# EAGLE design AmbaSat-05-ZMOD4410 (EAGLE 9.5.1)
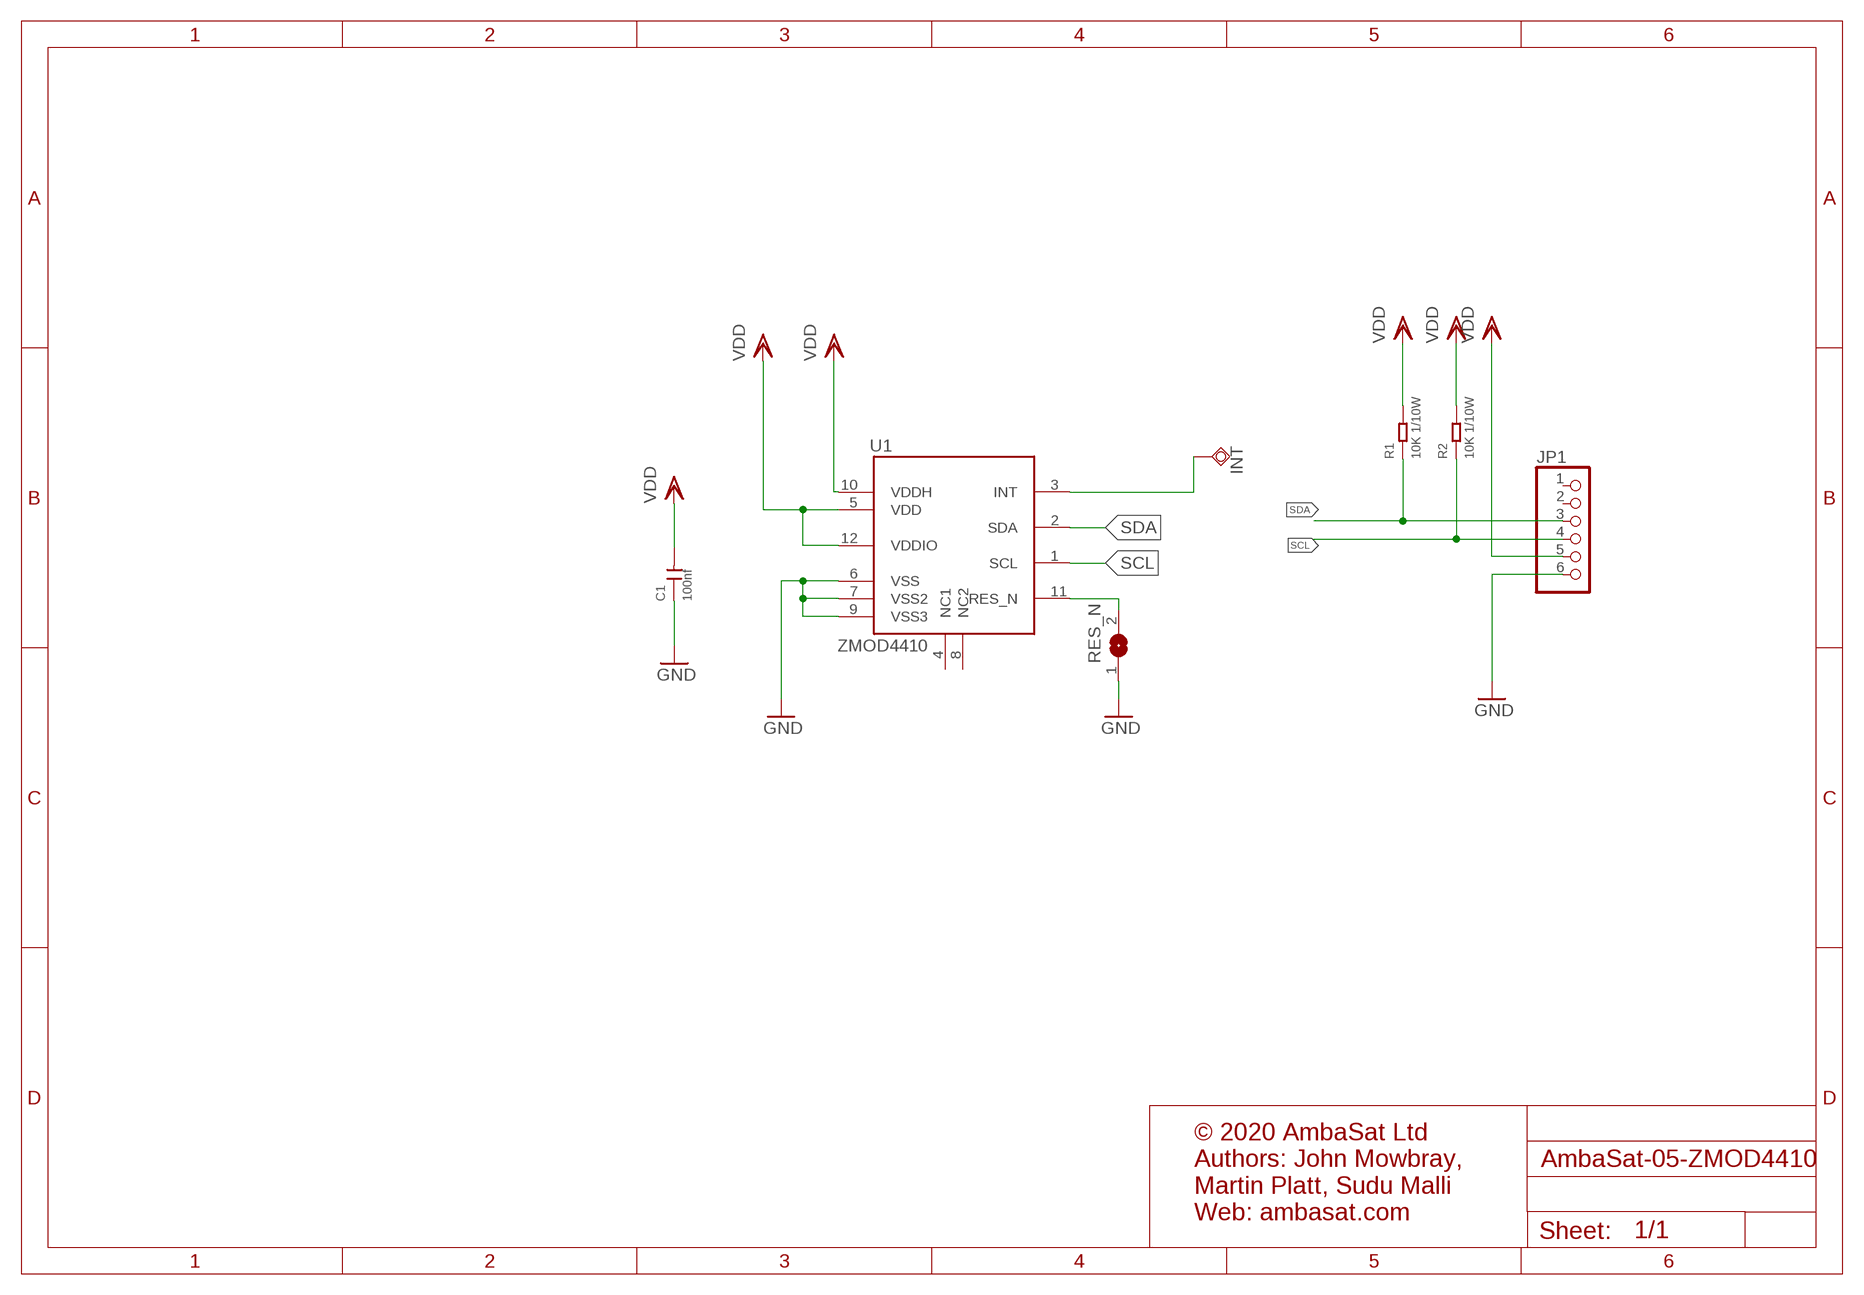
[diagram p0: schematic, sheet 1]

## Parts
C1  100nf  CERAMIC-100NF-50V-10%-X7R(0603)  [C0603]
INT  TESTPAD_TPSQTP12R  [TESTPAD_TP12R]
JP1  HEADER-1X6  [1X06_OVAL]
R1  10K 1/10W  SMD-RES-10K-5%-1/10W(0603)  [R0603]
R2  10K 1/10W  SMD-RES-10K-5%-1/10W(0603)  [R0603]
RES_N  SJ  [SJ]
U1  ZMOD4410  [LGG12D1_3X3X0.7_0.5X1]

## Nets
GND: C1.1 JP1.6 RES_N.1 U1.6(VSS) U1.7(VSS2) U1.9(VSS3)
N$1: INT.TP U1.3(INT)
N$2: RES_N.2 U1.11(RES_N)
SCL: JP1.4 R2.1 U1.1(SCL)
SDA: JP1.3 R1.1 U1.2(SDA)
VDD: C1.2 JP1.5 R1.2 R2.2 U1.5(VDD) U1.10(VDDH) U1.12(VDDIO)
Unconnected: JP1.1 JP1.2 U1.4(NC1) U1.8(NC2)

## Notes on the sheet
- © 2020 AmbaSat Ltd
  Authors: John Mowbray, 
  Martin Platt, Sudu Malli
  Web: ambasat.com

## Library data of the parts
C1 = Seeed-Capacitor:CERAMIC-100NF-50V-10%-X7R(0603): 302010138; MPN: CC0603KRX7R9BB104
INT = BeagleBone_Blue_R3:TESTPAD_TPSQ: Test pad
JP1 = microbuilder:HEADER-1X6: PIN HEADER
R1 R2 = Seeed-Resistor:SMD-RES-10K-5%-1/10W(0603): 301010293; MPN: RC0603JR-0710KL
RES_N = jumper:SJ: SMD solder JUMPER
U1 = ZMOD4410AI1V:ZMOD4410: Description The ZMOD4410 Gas Sensor Module is designed for detecting total volatile organic compounds (TVOC) and monitoring indoor air quality (IAQ) in different use cases. It is a 12-pin LGA assembly (3.0  3.0  0.7 mm) that consists of a gas sense element and a CMOS signal conditioning IC. The module’s sense element consists of heater element on a Si-based MEMS structure and a metal oxide (MOx) chemiresistor. The signal conditioner controls the sensor temperature and measures the MOx conductivity, which is a function of the gas concentration. The measurement results can be read via an I2C interface with the user’s microprocessor, which processes the data to determine the TVOC concentration, IAQ rating, and estimated carbon dioxide (eCO2) level. Alternatively, depending on the operation mode, the ZMOD4410 software can generate a control signal, which can trigger actions based on odor levels. With its low operating current consumption in Low-Power Operation Mode, the ZMOD4410 is an excellent choice for low-voltage and low-power battery applications. Built-in nonvolatile memory (NVM) stores the configuration and provides space for arbitrary user data.; DIGIKEY-PN: 1833-1030-ND; MANUFACTURER: IDT, Integrated Device Technology Inc; MPN: ZMOD4410AI1V

## Board
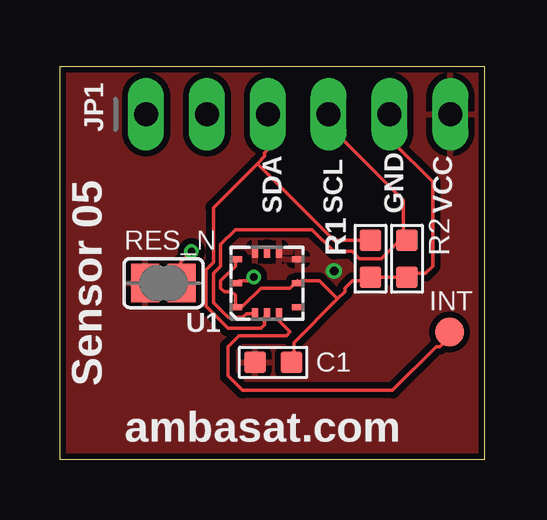
[diagram p1: board, top side]
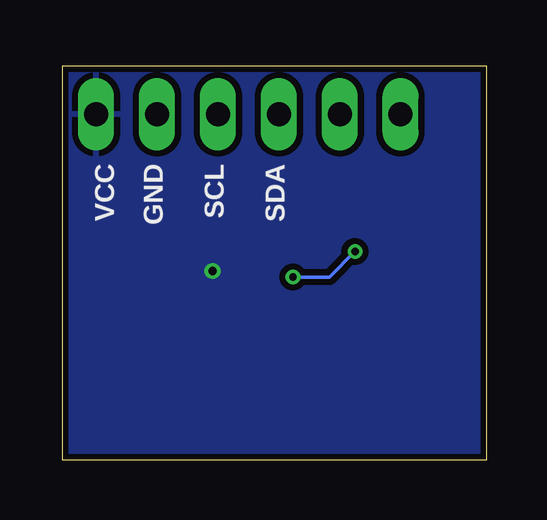
[diagram p2: board, bottom side, seen from below]

Size 17.7 x 16.4 mm. Coordinates in mm from the lower left corner, seen from the top.
Outline: 0,16.4 17.7,16.4 17.7,0 0,0 0,16.4
Copper layers (1*16): Top 0.035mm / dielectric 1.5mm / Bottom 0.035mm
Design rules "SeeedStudio_2layer_DRU_no_angle_20140221": minimum track width 6mil, minimum drill 12mil, track to track 6mil, track to pad 6mil, pad to pad 6mil, via to via 6mil, smd to smd 0mil, copper to edge 10mil, drill to drill 10mil, minimum pad ring 10mil, minimum via ring 6mil, stop-mask expansion 2mil, vias tented up to drill 100mil, thermal gap 10mil

### Footprints (pad centres in the part's own frame; a part is rotated, then mirrored left to right if it is on the bottom)
C0603 = smd 0.889 x 0.889: 1 0,0.762; 2 0,-0.762
TESTPAD_TP12R = smd 1.2 x 1.2: TP 0,0
1X06_OVAL = drill 1 long: 1 -6.35,0; 2 -3.81,0; 3 -1.27,0; 4 1.27,0; 5 3.81,0; 6 6.35,0
R0603 = smd 0.889 x 0.889: 1 0,0.762; 2 0,-0.762
SJ = smd 1.168 x 1.6: 1 -0.762,0; 2 0.762,0
LGG12D1_3X3X0.7_0.5X1 = smd 0.25 x 0.5: 1 -0.5,-1.3; 2 0,-1.3; 3 0.5,-1.3; 7 0.5,1.3; 8 0,1.3; 9 -0.5,1.3 | smd 0.5 x 0.25: 4 1.3,-1; 5 1.3,0; 6 1.3,1; 10 -1.3,1; 11 -1.3,0; 12 -1.3,-1

### Placement (x,y rotation side)
C1  8.89,4.06 90 top
INT  16.26,5.33 0 top
JP1  9.94,14.4 0 top
R1  12.95,8.38 0 top
R2  14.48,8.38 0 top
RES_N  4.32,7.37 0 top
U1  8.64,7.37 0 top

### Tracks (layer width: path | path; a pad name or v marks a point on that pad's centre or on a via)
GND  (via drill 0.35)
  other vias: 11.43,7.87
  pour Top (isolate 0.254): 0,16.4 0,0 17.7,0 17.7,16.4
  pour Bottom (isolate 0.254): 0,16.4 0,0 17.7,0 17.7,16.4
N$1
  Top 0.152: U1.3 9.14,5.94 9.14,5.79 9.6,5.33 9.45,5.18 7.47,5.18 7.01,4.72 7.01,3.5 7.62,2.9 13.87,2.9 15.7,4.72 15.85,4.72 16.15,5.03 16.15,5.33 INT.TP
N$2  (via drill 0.3)
  Top 0.152: v8.08,7.62 7.92,7.47 7.47,7.47 U1.11 | v5.49,8.69 5.03,8.23 5.03,7.47 RES_N.2
  Bottom 0.152: v8.08,7.62 6.55,7.62 v5.49,8.69
SCL
  Top 0.152: 14.33,9.14 14.17,9.14 13.41,8.38 12.5,8.38 12.19,8.69 11.43,8.69 10.52,9.6 7.32,9.6 6.71,8.99 6.71,8.08 6.4,7.77 6.4,6.55 7.01,5.94 7.62,5.94 7.77,6.1 8.08,6.1 U1.1 | 14.33,9.14 14.33,10.82 11.28,13.87 11.28,14.33 JP1.4 | 14.33,9.14 R2.1
SDA
  Top 0.152: 8.23,12.34 8.53,12.65 8.53,12.8 8.69,12.95 8.69,14.33 JP1.3 | 8.23,12.34 6.4,10.52 6.4,8.23 6.1,7.92 6.1,6.4 7.01,5.49 8.38,5.49 8.53,5.64 8.53,5.94 U1.2 | R1.1 11.43,9.14 8.23,12.34
VDD
  Top 0.152: U1.10 7.32,8.38 7.32,8.08 6.71,7.47 6.71,7.16 6.86,7.01 7.16,7.01 7.32,6.86 7.32,6.4 U1.12 7.47,6.4 7.62,6.4 8.38,7.16 9.6,7.16 9.91,7.47 U1.5 10.06,7.47 10.82,7.47 11.58,6.71 | 11.58,6.71 11.89,7.01 11.89,7.16 12.19,7.47 12.8,7.47 R1.2 R2.2 14.63,7.77 15.24,7.77 15.54,8.08 15.54,11.58 13.87,13.26 13.87,14.33 JP1.5 | 11.58,6.71 9.75,4.88 9.75,4.12 C1.2

### Text on the board
tPlace: Sensor 05 | SDA | SCL | GND | VCC | ambasat.com
bPlace: SDA | SCL | GND | VCC